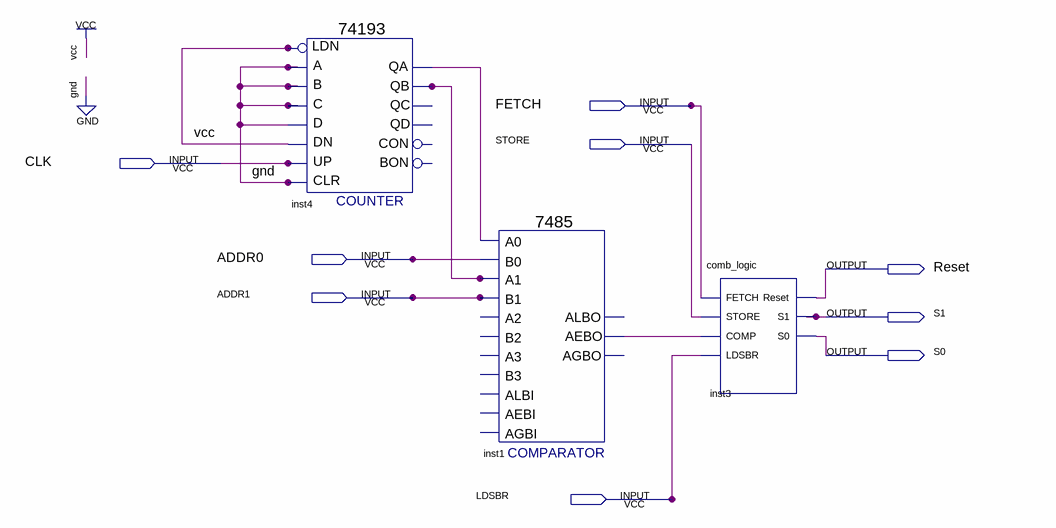
[diagram p0: schematic sheet]
// Quartus schematic control_unit.bdf as structural Verilog: 3 symbols, 9 pins
module control_unit (
  input  FETCH,
  input  STORE,
  input  CLK,
  input  ADDR0,
  input  ADDR1,
  input  LDSBR,
  output Reset,
  output S1,
  output S0
);

  wire inst1_aebo, inst4_qa, inst4_qb;

  \74193  inst4 (
    .D(1'b0), .C(1'b0), .B(1'b0), .A(1'b0), .CLR(1'b0), .UP(CLK), .DN(1'b1), .LDN(1'b1), .QB(inst4_qb),
    .QA(inst4_qa));  // open: CON, QD, QC, BON
  \7485  inst1 (
    .A0(inst4_qa), .B0(ADDR0), .A1(inst4_qb), .B1(ADDR1), .AEBO(inst1_aebo));  // open: A3, B2, A2, AEBI, AGBI, ALBI, B3, ALBO, AGBO
  comb_logic inst3 (.FETCH(FETCH), .STORE(STORE), .COMP(inst1_aebo), .LDSBR(LDSBR), .Reset(Reset), .S1(S1), .S0(S0));
endmodule
